# EAGLE design display2 (EAGLE 5.00)
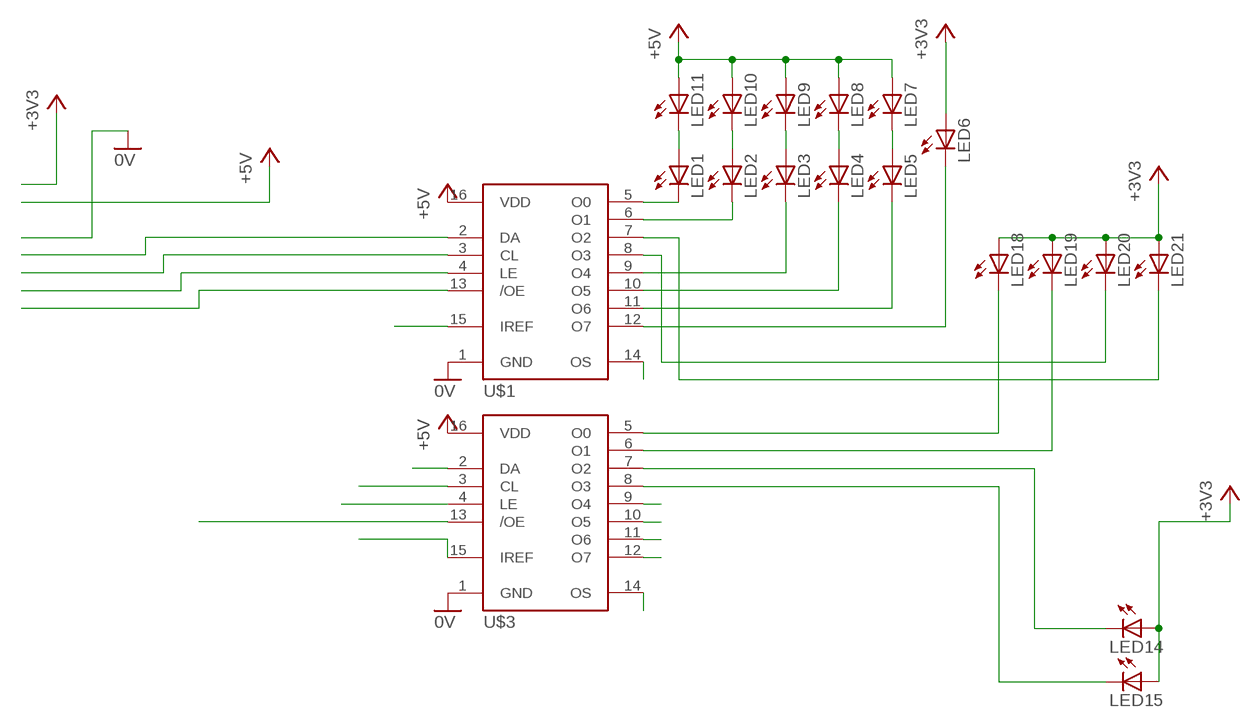
[diagram p0: schematic, sheet 1]

## Parts
LED1  LED5MM  [LED5MM]
LED2  LED5MM  [LED5MM]
LED3  LED5MM  [LED5MM]
LED4  LED5MM  [LED5MM]
LED5  LED5MM  [LED5MM]
LED6  LED5MM  [LED5MM]
LED7  LED5MM  [LED5MM]
LED8  LED5MM  [LED5MM]
LED9  LED5MM  [LED5MM]
LED10  LED5MM  [LED5MM]
LED11  LED5MM  [LED5MM]
LED14  LED5MM  [LED5MM]
LED15  LED5MM  [LED5MM]
LED18  LED5MM  [LED5MM]
LED19  LED5MM  [LED5MM]
LED20  LED5MM  [LED5MM]
LED21  LED5MM  [LED5MM]
U$1  A6275WSOIC16  [WSOIC16]
U$3  A6275WSOIC16  [WSOIC16]

## Nets
0V: U$1.1(GND) U$3.1(GND)
+3V3: LED6.A LED14.A LED15.A LED18.A LED19.A LED20.A LED21.A
+5V: LED7.A LED8.A LED9.A LED10.A LED11.A U$1.16(VDD) U$3.16(VDD)
N$1: LED1.K(C) U$1.5(O0)
N$2: LED2.K(C) U$1.6(O1)
N$3: LED3.K(C) U$1.9(O4)
N$4: LED4.K(C) U$1.10(O5)
N$5: LED5.K(C) U$1.11(O6)
N$6: LED6.K(C) U$1.12(O7)
N$7: LED18.K(C) U$3.5(O0)
N$8: LED19.K(C) U$3.6(O1)
N$9: LED20.K(C) U$1.8(O3)
N$10: LED14.K(C) U$3.7(O2)
N$11: U$1.2(DA)
N$12: U$1.3(CL)
N$13: U$1.4(LE)
N$14: U$3.2(DA)
N$16: LED1.A LED11.K(C)
N$17: LED2.A LED10.K(C)
N$18: LED3.A LED9.K(C)
N$19: LED4.A LED8.K(C)
N$20: LED5.A LED7.K(C)
N$21: U$3.3(CL)
N$22: U$3.4(LE)
N$23: U$3.13(/OE)
N$24: U$1.13(/OE)
N$25: LED15.K(C) U$3.8(O3)
N$26: U$1.15(IREF)
N$27: U$3.15(IREF)
N$32: LED21.K(C) U$1.7(O2)
S$1: U$3.9(O4)
S$3: U$3.11(O6)
S$6: U$3.10(O5)
S$7: U$3.12(O7)
S$9: U$1.14(OS)
S$10: U$3.14(OS)

## Library data of the parts
LED1-LED11 LED14 LED15 LED18-LED21 = led:LED: LED OSRAM: - CHIPLED LG R971, LG N971, LY N971, LG Q971, LY Q971, LO R971, LY R971 LH N974, LH R974 LS Q976, LO Q976, LY Q976 LO Q996 - Hyper CHIPLED LW Q18S LB Q993, LB Q99A, LB R99A - SideLED LS A670, LO A670, LY A670, LG A670, LP A670 LB A673, LV A673, LT A673, LW A673 LH A674 LY A675 LS A676, LA A676, LO A676, LY A676, LW A676 LS A679, LY A679, LG A679 - Hyper Micro SIDELED® LS Y876, LA Y876, LO Y876, LY Y876 LT Y87S - SmartLED LW L88C, LW L88S LB L89C, LB L89S, LG L890 LS L89K, LO L89K, LY L89K LS L896, LA L896, LO L896, LY L896 - TOPLED LS T670, LO T670, LY T670, LG T670, LP T670 LSG T670, LSP T670, LSY T670, LOP T670, LYG T670 LG T671, LOG T671, LSG T671 LB T673, LV T673, LT T673, LW T673 LH T674 LS T676, LA T676, LO T676, LY T676, LB T676, LH T676, LSB T676, LW T676 LB T67C, LV T67C, LT T67C, LS T67K, LO T67K, LY T67K, LW E67C LS E67B, LA E67B, LO E67B, LY E67B, LB E67C, LV E67C, LT E67C LW T67C LS T679, LY T679, LG T679 LS T770, LO T770, LY T770, LG T770, LP T770 LB T773, LV T773, LT T773, LW T773 LH T774 LS E675, LA E675, LY E675, LS T675 LS T776, LA T776, LO T776, LY T776, LB T776 LHGB T686 LT T68C, LB T68C - Hyper Mini TOPLED® LB M676 - Mini TOPLED Santana® LG M470 LS M47K, LO M47K, LY M47K Source: http://www.osram.convergy.de - LUMILED® LXK2-PW12-R00, LXK2-PW12-S00, LXK2-PW14-U00, LXK2-PW14-V00 LXK2-PM12-R00, LXK2-PM12-S00, LXK2-PM14-U00 LXK2-PE12-Q00, LXK2-PE12-R00, LXK2-PE12-S00, LXK2-PE14-T00, LXK2-PE14-U00 LXK2-PB12-K00, LXK2-PB12-L00, LXK2-PB12-M00, LXK2-PB14-N00, LXK2-PB14-P00, LXK2-PB14-Q00 LXK2-PR12-L00, LXK2-PR12-M00, LXK2-PR14-Q00, LXK2-PR14-R00 LXK2-PD12-Q00, LXK2-PD12-R00, LXK2-PD12-S00 LXK2-PH12-R00, LXK2-PH12-S00 LXK2-PL12-P00, LXK2-PL12-Q00, LXK2-PL12-R00 Source: www.luxeon.com
U$1 U$3 = rnie04:A6275

## Board
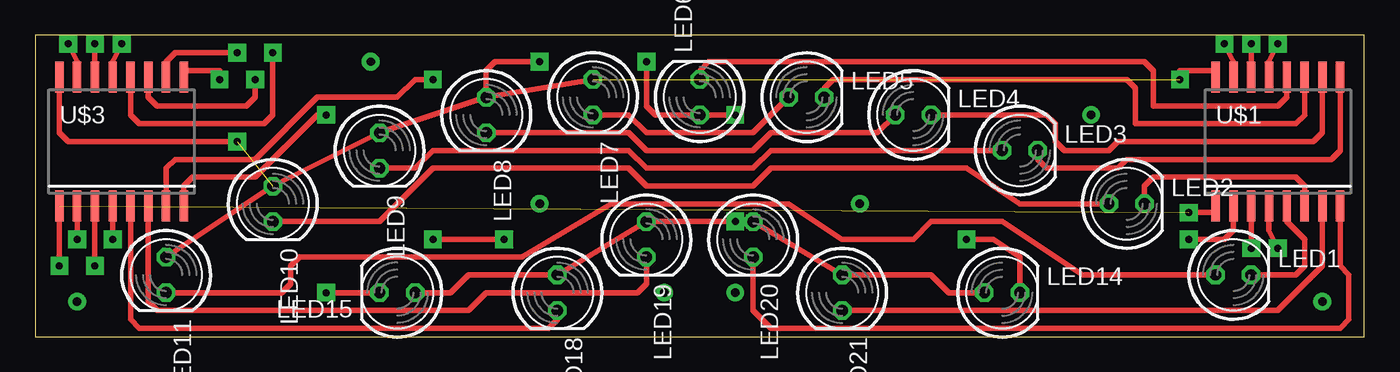
[diagram p1: board, top side]
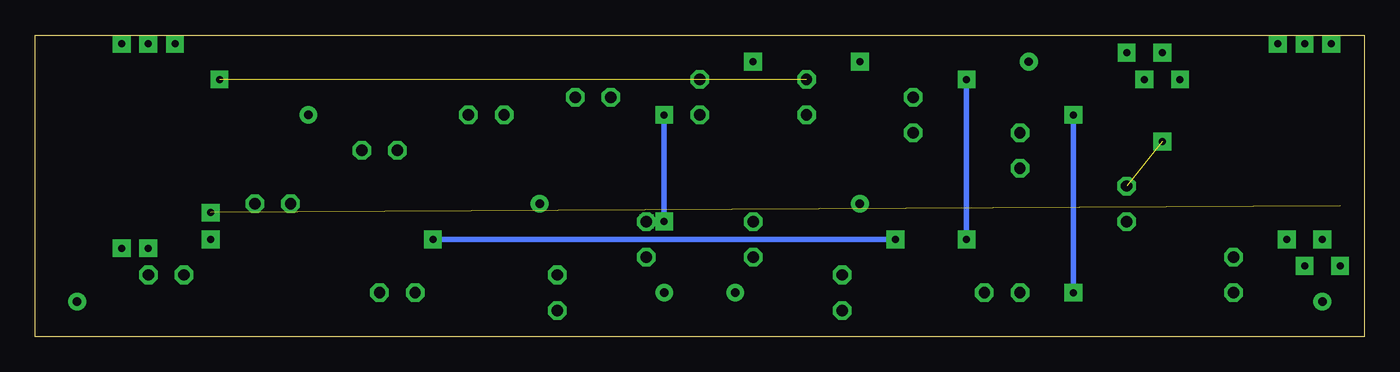
[diagram p2: board, bottom side, seen from below]

Size 94.92 x 21.58 mm. Coordinates in mm from the lower left corner, seen from the top.
Outline: 0,0 94.92,0 94.92,21.58 0,21.58 0,0
Copper layers (1*16): Top 0.035mm / dielectric 1.5mm / Bottom 0.035mm
Design rules "default": minimum track width 10mil, minimum drill 24mil, track to track 8mil, track to pad 8mil, pad to pad 8mil, via to via 8mil, smd to smd 8mil, copper to edge 40mil, drill to drill 8mil, minimum pad ring 10mil, minimum via ring 8mil, stop-mask expansion 4mil, vias tented up to drill 0mil, thermal gap 10mil

### Footprints (pad centres in the part's own frame; a part is rotated, then mirrored left to right if it is on the bottom)
LED5MM = drill 0.813 octagon: A -1.27,0; K 1.27,0
WSOIC16 = smd 0.6 x 2.2: 1 -4.445,-4.6; 2 -3.175,-4.6; 3 -1.905,-4.6; 4 -0.635,-4.6; 5 0.635,-4.6; 6 1.905,-4.6; 7 3.175,-4.6; 8 4.445,-4.6; 9 4.445,4.6; 10 3.175,4.6; 11 1.905,4.6; 12 0.635,4.6; 13 -0.635,4.6; 14 -1.905,4.6; 15 -3.175,4.6; 16 -4.445,4.6

### Placement (x,y rotation side)
LED1  85.56,4.44 0 top
LED2  77.94,9.52 0 top
LED3  70.32,13.33 0 top
LED4  62.7,15.87 0 top
LED5  55.08,17.14 0 top
LED6  47.46,17.14 90 top
LED7  39.84,17.14 270 top
LED8  32.22,15.87 270 top
LED9  24.6,13.33 270 top
LED10  16.98,9.52 270 top
LED11  9.36,4.44 270 top
LED14  69.05,3.17 0 top
LED15  25.87,3.17 180 top
LED18  37.3,3.17 270 top
LED19  43.65,6.98 270 top
LED20  51.27,6.98 270 top
LED21  57.62,3.17 270 top
U$1  88.74,13.96 0 top
U$3  6.19,13.96 0 top

### Tracks (layer width: path | path; a pad name or v marks a point on that pad's centre or on a via)
0V  (via drill 0.5 pad 1.27)  (1 unrouted)
  Top 0.406: v1.74,5.08 U$3.1 | v82.39,8.89 84.29,8.89 U$1.1
+3V3  (via drill 0.5 pad 1.27, 0.6)
  Top 0.406: v50,8.25 LED20.A | v50,8.25 LED19.A LED18.A 30.95,4.44 29.68,3.17 LED15.A | v50,8.25 LED20.A | LED20.A LED21.A 63.97,4.44 65.24,3.17 LED14.A | v50,15.87 LED6.A 44.28,15.87 43.65,16.51 v43.65,19.68
  Bottom 0.406: v50,8.25 v50,15.87
  other vias: 51.27,8.25
+5V  (via drill 0.5 pad 1.27)  (2 unrouted)
  Top 0.406: LED11.A LED10.A LED9.A LED8.A | LED8.A LED7.A | v81.75,18.41 81.75,19.05 84.29,19.05 U$1.16 | U$3.16 1.74,14.6 2.38,13.96 v14.44,13.96 | LED8.A 32.22,19.05 32.85,19.68 v36.03,19.68
N$1
  Top 0.406: LED1.K 90.01,4.44 90.64,5.08 90.64,6.98 89.37,8.25 U$1.5 89.37,10.16
N$2
  Top 0.406: LED2.K 79.21,10.79 79.85,11.43 90.01,11.43 90.64,10.79 U$1.6
N$3
  Top 0.406: LED3.K 71.59,12.7 72.23,12.06 77.31,12.06 77.94,12.7 92.55,12.7 93.18,13.33 U$1.9
N$4
  Top 0.406: LED4.K 72.23,15.87 72.86,15.24 72.86,13.96 73.5,13.33 76.67,13.33 77.31,13.96 91.28,13.96 91.91,14.6 U$1.10
N$5
  Top 0.406: LED5.K 56.35,17.77 56.98,18.41 77.94,18.41 78.58,17.77 78.58,15.24 90.01,15.24 90.64,15.87 U$1.11
N$6
  Top 0.406: LED6.K 47.46,19.05 48.09,19.68 79.21,19.68 79.85,19.05 79.85,16.51 88.74,16.51 89.37,17.14 U$1.12
N$7
  Top 0.406: LED18.K 37.3,1.27 36.66,0.63 7.46,0.63 6.82,1.27 U$3.5
N$8
  Top 0.406: LED19.K 43.65,3.8 43.02,3.17 32.22,3.17 30.95,1.9 8.72,1.9 8.09,2.54 U$3.6
N$9
  Top 0.406: U$1.8 93.18,5.08 93.82,4.44 93.82,1.27 93.18,0.63 52.54,0.63 51.27,1.9 LED20.K
N$10  (via drill 0.5 pad 1.27)
  Top 0.406: LED14.K 70.32,5.71 68.42,6.98 v66.51,6.98 | v28.41,6.98 v33.49,6.98 | v28.41,18.41 27.14,18.41 25.87,17.14 20.16,17.14 15.71,12.7 9.99,12.7 9.36,12.06 U$3.7
  Bottom 0.406: v33.49,6.98 v66.51,6.98 | v28.41,18.41 v28.41,6.98
N$11  (via drill 0.5 pad 1.27)
  Top 0.406: v82.39,6.98 84.93,6.98 85.56,7.62 U$1.2
N$12  (via drill 0.5 pad 1.27)
  Top 0.406: v86.83,6.35 U$1.3
N$13  (via drill 0.5 pad 1.27)
  Top 0.406: U$1.4 88.1,7.62 v88.74,6.35
N$14  (via drill 0.5 pad 1.27)
  Top 0.406: v3.01,6.98 U$3.2
N$15  (via drill 0.6 pad 1.27)
  other vias: 50,3.17
N$16
  Top 0.406: LED11.K 17.61,3.17 18.25,3.8 18.25,5.08 18.88,5.71 34.76,5.71 41.11,9.52 53.81,9.52 57.62,6.98 62.7,6.98 63.97,8.25 69.05,8.25 74.77,4.44 LED1.A
N$17
  Top 0.406: LED10.K 24.6,8.25 28.41,12.06 42.38,12.06 43.65,10.79 51.27,10.79 52.54,12.06 66.51,12.06 70.32,9.52 LED2.A
N$18
  Top 0.406: LED9.K 27.14,12.06 28.41,13.33 42.38,13.33 43.65,12.06 51.27,12.06 52.54,13.33 LED3.A
N$19
  Top 0.406: LED8.K 42.38,14.6 43.65,13.33 51.27,13.33 52.54,14.6 60.16,14.6 LED4.A
N$20
  Top 0.406: LED7.K 42.38,15.87 43.65,14.6 51.27,14.6 LED5.A
N$21  (via drill 0.5 pad 1.27)
  Top 0.406: v4.28,5.08 U$3.3
N$22  (via drill 0.5 pad 1.27)
  Top 0.406: v5.55,6.98 U$3.4
N$23  (via drill 0.5 pad 1.27)
  Top 0.406: U$3.13 5.55,19.68 v6.19,20.95
N$24  (via drill 0.5 pad 1.27)
  Top 0.406: U$1.13 88.1,19.68 v88.74,20.95
N$25  (via drill 0.5 pad 1.27)
  Top 0.406: v20.79,3.17 LED15.K | U$3.8 10.63,10.79 11.27,11.43 15.71,11.43 20.16,15.87 v20.79,15.87
  Bottom 0.406: v20.79,15.87 v20.79,3.17
N$26  (via drill 0.5 pad 1.27)
  Top 0.406: U$1.15 85.56,19.68 v84.93,20.95
N$27  (via drill 0.5 pad 1.27)
  Top 0.406: U$3.15 3.01,19.68 v2.38,20.95
N$28  (via drill 0.6 pad 1.27)
  other vias: 3.01,2.54
N$29  (via drill 0.6 pad 1.27)
  other vias: 91.91,2.54
N$30  (via drill 0.6 pad 1.27)
  other vias: 44.92,3.17
N$31  (via drill 0.6 pad 1.27)
  other vias: 23.96,19.68
N$32
  Top 0.406: LED21.K 88.74,1.9 91.91,5.08 U$1.7
N$33  (via drill 0.6 pad 1.27)
  other vias: 75.4,15.87
S$1  (via drill 0.5 pad 1.27)
  Top 0.406: U$3.9 10.63,19.05 13.17,19.05 v13.17,18.41
S$3  (via drill 0.5 pad 1.27)
  Top 0.406: U$3.11 8.09,17.14 8.72,16.51 15.07,16.51 15.71,17.14 v15.71,18.41
S$5  (via drill 0.6 pad 1.27)
  other vias: 58.89,9.52
S$6  (via drill 0.5 pad 1.27)
  Top 0.406: U$3.10 9.36,19.68 9.99,20.32 v14.44,20.32
S$7  (via drill 0.5 pad 1.27)
  Top 0.406: U$3.12 6.82,15.87 7.46,15.24 16.34,15.24 16.98,15.87 v16.98,20.32
S$9  (via drill 0.5 pad 1.27)
  Top 0.406: U$1.14 v86.83,20.95
S$10  (via drill 0.5 pad 1.27)
  Top 0.406: U$3.14 v4.28,20.95
S$11  (via drill 0.6 pad 1.27)
  other vias: 36.03,9.52